# Altium schematic sheet Title.SchDoc
size B; DocumentNumber: 1; SheetNumber: 1; SheetTotal: 9; ENG_APP_DATE: --/--/--; DSN_APP_DATE: --/--/--; CHK_APP_DATE: --/--/--
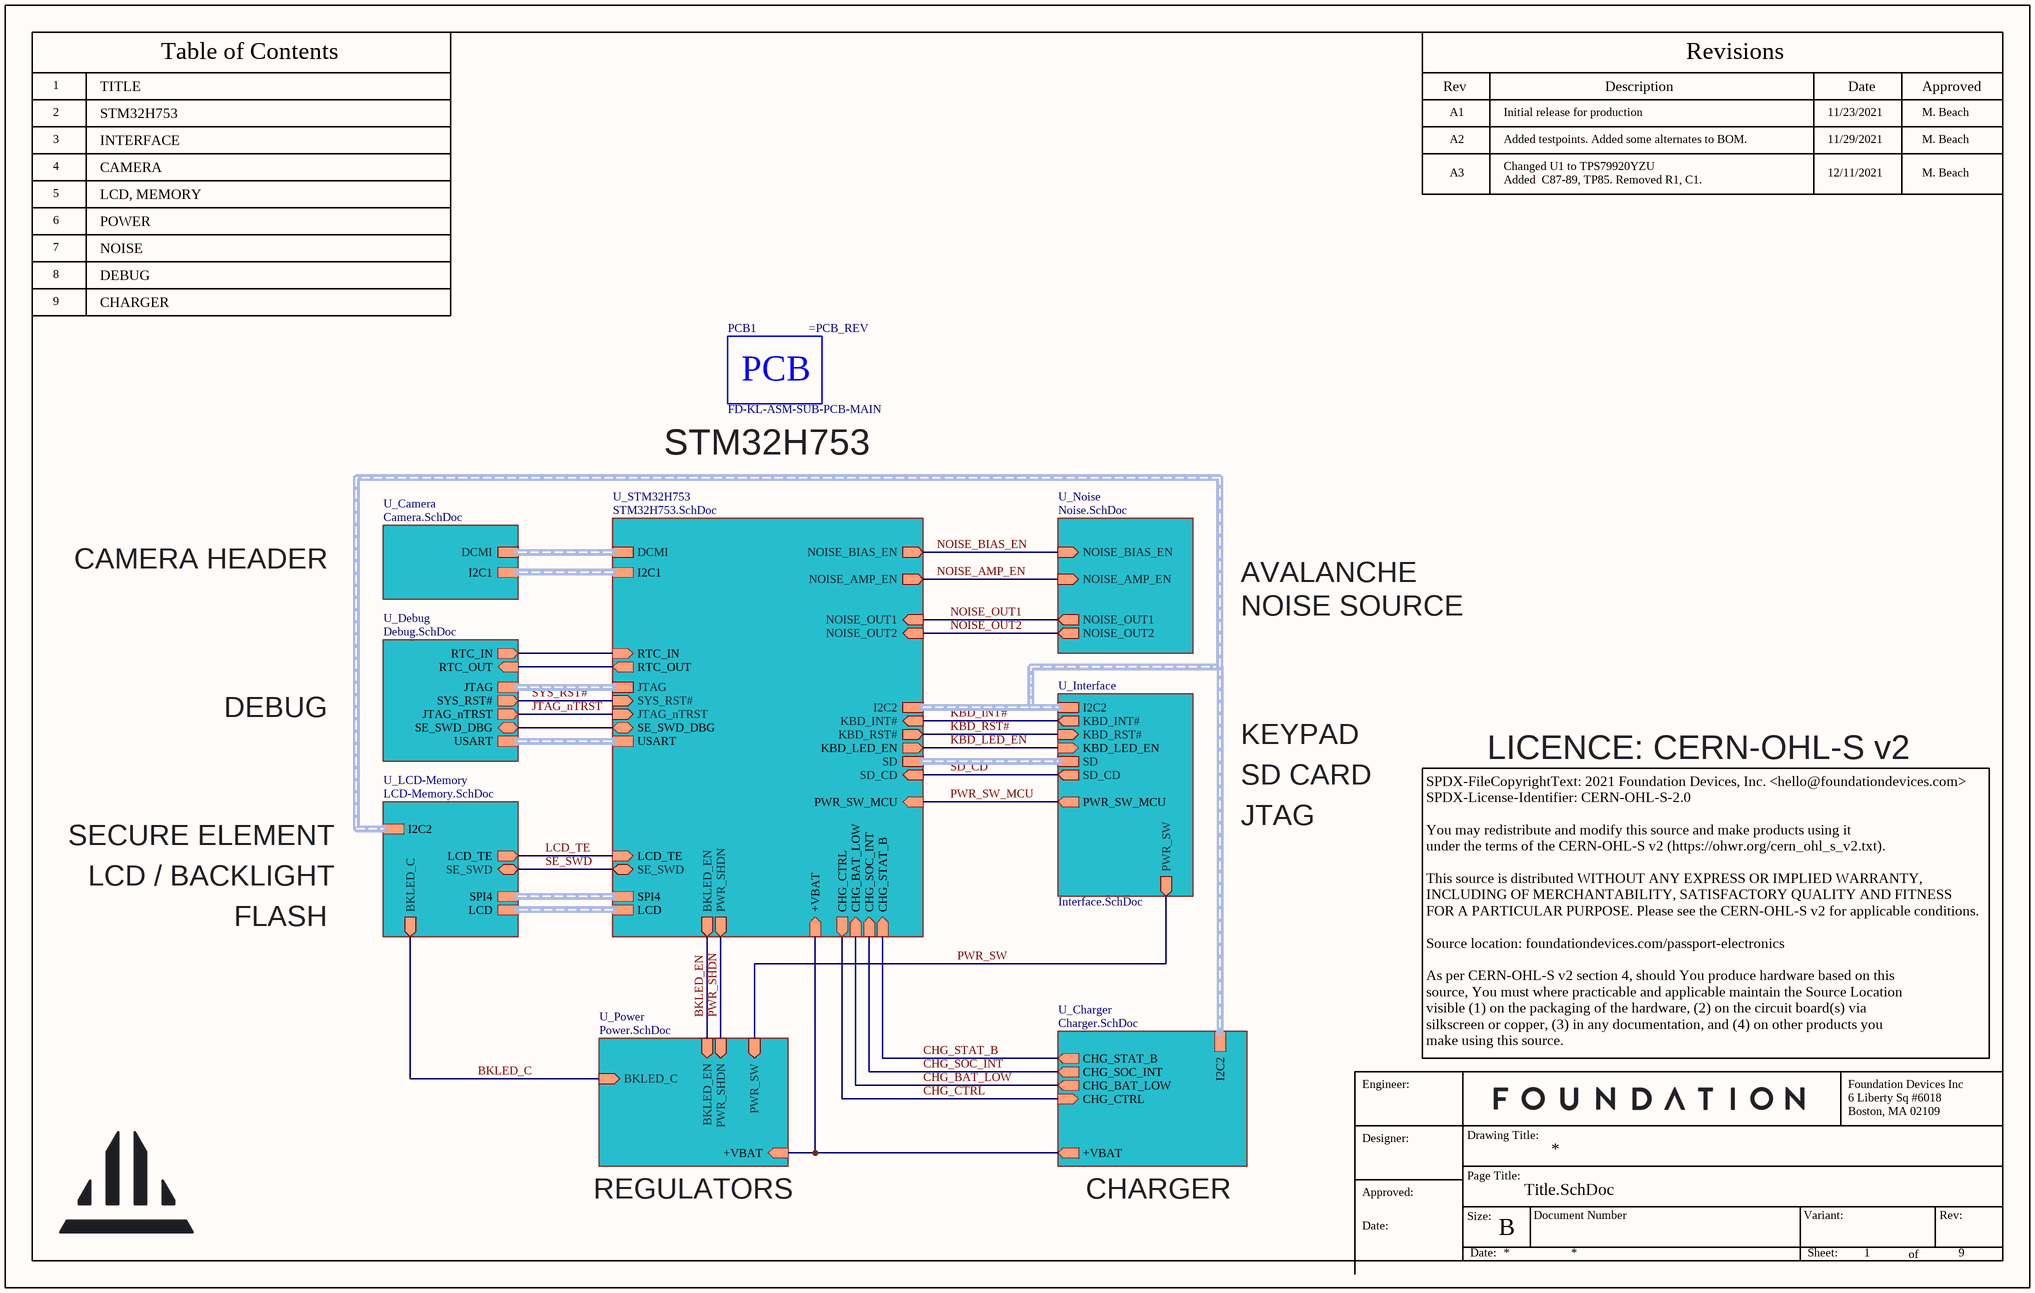
[diagram p0: Title.SchDoc]

## Parts
PCB1  FD-KL-ASM-SUB-PCB-MAIN  (mechanical)

## Sub-sheets
U_Camera = Camera.SchDoc: DCMI (harness DCMI), I2C1 (harness I2C)
U_Charger = Charger.SchDoc: CHG_STAT_B (out), CHG_SOC_INT (out), +VBAT (out), CHG_CTRL (in), CHG_BAT_LOW (out), I2C2 (harness I2C)
U_Debug = Debug.SchDoc: SYS_RST# (out), JTAG_nTRST (out), JTAG (harness JTAG), USART (harness USART), SE_SWD_DBG (bidir), RTC_IN (out), RTC_OUT (in)
U_Interface = Interface.SchDoc: I2C2 (harness I2C), KBD_INT# (out), SD (harness SD_Card), KBD_RST# (in), SD_CD (out), PWR_SW (out), KBD_LED_EN (in), PWR_SW_MCU (out)
U_LCD-Memory = LCD-Memory.SchDoc: BKLED_C (out), SE_SWD (bidir), LCD (harness LCD), SPI4 (harness SPI), LCD_TE (out), I2C2 (harness I2C)
U_Noise = Noise.SchDoc: NOISE_OUT1 (out), NOISE_BIAS_EN (in), NOISE_OUT2 (out), NOISE_AMP_EN (in)
U_Power = Power.SchDoc: BKLED_C (in), BKLED_EN (in), PWR_SHDN (in), PWR_SW (in), +VBAT (in)
U_STM32H753 = STM32H753.SchDoc: SD (harness SD_Card), KBD_INT# (in), I2C2 (harness I2C), JTAG (harness JTAG), DCMI (harness DCMI), KBD_RST# (out), SE_SWD (bidir), BKLED_EN (out), SD_CD (in), JTAG_nTRST (in), PWR_SHDN (out), SYS_RST# (in), NOISE_BIAS_EN (out), NOISE_AMP_EN (out), NOISE_OUT1 (in), NOISE_OUT2 (in), LCD (harness LCD), I2C1 (harness I2C), SPI4 (harness SPI), USART (harness USART), KBD_LED_EN (out), CHG_STAT_B (in), CHG_SOC_INT (in), CHG_BAT_LOW (in), CHG_CTRL (out), LCD_TE (in), +VBAT (in), SE_SWD_DBG (bidir), PWR_SW_MCU (in), RTC_IN (in), RTC_OUT (out)

## Nets
BKLED_C: sheet U_LCD-Memory/BKLED_C, sheet U_Power/BKLED_C
BKLED_EN: sheet U_STM32H753/BKLED_EN, sheet U_Power/BKLED_EN
CHG_BAT_LOW: sheet U_STM32H753/CHG_BAT_LOW, sheet U_Charger/CHG_BAT_LOW
CHG_CTRL: sheet U_STM32H753/CHG_CTRL, sheet U_Charger/CHG_CTRL
CHG_SOC_INT: sheet U_STM32H753/CHG_SOC_INT, sheet U_Charger/CHG_SOC_INT
CHG_STAT_B: sheet U_STM32H753/CHG_STAT_B, sheet U_Charger/CHG_STAT_B
JTAG_nTRST: sheet U_STM32H753/JTAG_nTRST, sheet U_Debug/JTAG_nTRST
KBD_INT#: sheet U_STM32H753/KBD_INT#, sheet U_Interface/KBD_INT#
KBD_LED_EN: sheet U_STM32H753/KBD_LED_EN, sheet U_Interface/KBD_LED_EN
KBD_RST#: sheet U_STM32H753/KBD_RST#, sheet U_Interface/KBD_RST#
LCD_TE: sheet U_STM32H753/LCD_TE, sheet U_LCD-Memory/LCD_TE
NOISE_AMP_EN: sheet U_STM32H753/NOISE_AMP_EN, sheet U_Noise/NOISE_AMP_EN
NOISE_BIAS_EN: sheet U_STM32H753/NOISE_BIAS_EN, sheet U_Noise/NOISE_BIAS_EN
NOISE_OUT1: sheet U_STM32H753/NOISE_OUT1, sheet U_Noise/NOISE_OUT1
NOISE_OUT2: sheet U_STM32H753/NOISE_OUT2, sheet U_Noise/NOISE_OUT2
PWR_SHDN: sheet U_STM32H753/PWR_SHDN, sheet U_Power/PWR_SHDN
PWR_SW: sheet U_Interface/PWR_SW, sheet U_Power/PWR_SW
PWR_SW_MCU: sheet U_STM32H753/PWR_SW_MCU, sheet U_Interface/PWR_SW_MCU
SD_CD: sheet U_STM32H753/SD_CD, sheet U_Interface/SD_CD
SE_SWD: sheet U_STM32H753/SE_SWD, sheet U_LCD-Memory/SE_SWD
SYS_RST#: sheet U_STM32H753/SYS_RST#, sheet U_Debug/SYS_RST#
(unnamed): sheet U_STM32H753/+VBAT, sheet U_Power/+VBAT, sheet U_Charger/+VBAT
(unnamed): sheet U_STM32H753/SE_SWD_DBG, sheet U_Debug/SE_SWD_DBG
(unnamed): sheet U_STM32H753/RTC_IN, sheet U_Debug/RTC_IN
(unnamed): sheet U_STM32H753/RTC_OUT, sheet U_Debug/RTC_OUT

## Buses and harness runs
harness sheet U_Camera/DCMI = sheet U_STM32H753/DCMI
harness sheet U_Camera/I2C1 = sheet U_STM32H753/I2C1
harness sheet U_Charger/I2C2 = sheet U_Interface/I2C2 = sheet U_LCD-Memory/I2C2 = sheet U_STM32H753/I2C2
harness sheet U_Debug/JTAG = sheet U_STM32H753/JTAG
harness sheet U_Debug/USART = sheet U_STM32H753/USART
harness sheet U_Interface/SD = sheet U_STM32H753/SD
harness sheet U_LCD-Memory/LCD = sheet U_STM32H753/LCD
harness sheet U_LCD-Memory/SPI4 = sheet U_STM32H753/SPI4

## Notes on the sheet
- TITLE
- 2
- 3
- STM32H753
- INTERFACE
- CAMERA
- A1
- A2
- Initial release for production
- Added testpoints. Added some alternates to BOM.
- 11/23/2021
- 11/29/2021
- M. Beach
- 4
- 5
- 6
- LCD, MEMORY
- POWER
- A3
- Changed U1 to TPS79920YZU
- Added  C87-89, TP85. Removed R1, C1.
- 12/11/2021
- 7
- 8
- NOISE
- DEBUG
- CHARGER
- 9
- (near PCB1) STM32H753
- CAMERA HEADER
- AVALANCHE
- NOISE SOURCE
- KEYPAD
- SD CARD
- LICENCE: CERN-OHL-S v2
- SECURE ELEMENT
- JTAG
- FLASH
- LCD / BACKLIGHT
- SPDX-FileCopyrightText: 2021 Foundation Devices, Inc. <hello@foundationdevices.com>
  SPDX-License-Identifier: CERN-OHL-S-2.0
  You may redistribute and modify this source and make products using it
  under the terms of the CERN-OHL-S v2 (https://ohwr.org/cern_ohl_s_v2.txt).
  This source is distributed WITHOUT ANY EXPRESS OR IMPLIED WARRANTY,
  INCLUDING OF MERCHANTABILITY, SATISFACTORY QUALITY AND FITNESS
  FOR A PARTICULAR PURPOSE. Please see the CERN-OHL-S v2 for applicable conditions.
  Source location: foundationdevices.com/passport-electronics
  As per CERN-OHL-S v2 section 4, should You produce hardware based on this
  source, You must where practicable and applicable maintain the Source Location
  visible (1) on the packaging of the hardware, (2) on the circuit board(s) via
  silkscreen or copper, (3) in any documentation, and (4) on other products you
  make using this source.
- REGULATORS
- 1
- Table of Contents
- Rev
- Description
- Revisions
- Date
- Approved
- Engineer:
- Foundation Devices Inc
- 6 Liberty Sq #6018
- Designer:
- Drawing Title:
- Page Title:
- Boston, MA 02109
- Approved:
- Date:
- Size:
- B
- Document Number
- Variant:
- Rev:
- Sheet:
- of

## Library data of the parts
PCB1 = CMP-MISC-00007-1: Printed Circuit Board; Rev: =PCB_REV